# Altium project Timingcard_PROJECT.PrjPcb
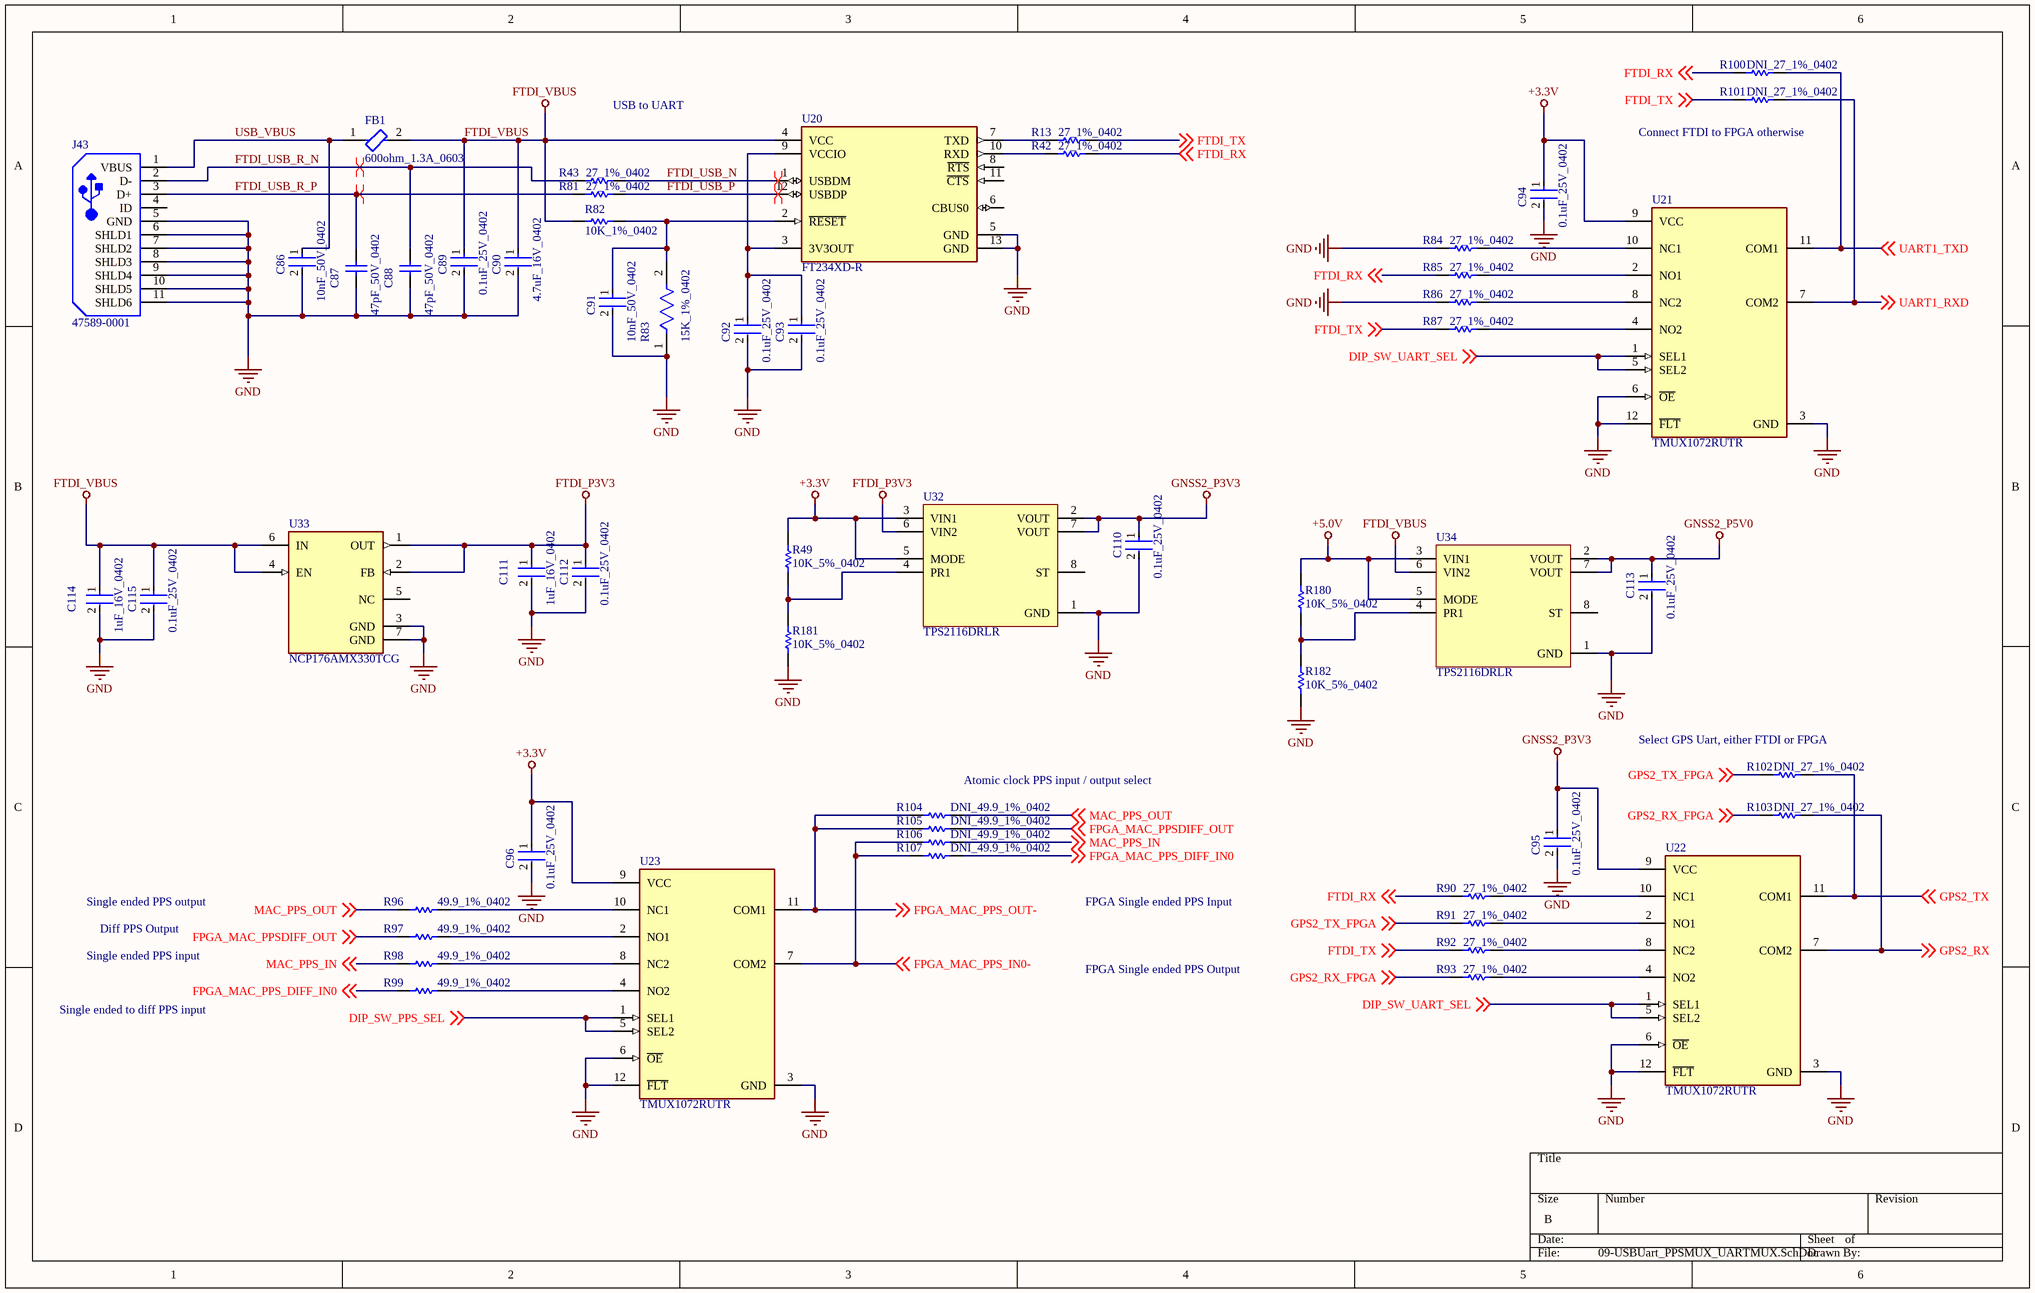
[diagram p0: 09-USBUart_PPSMUX_UARTMUX.SchDoc]
ProjectDate: 09/14/21; ProjectRevision: P3
1 sheet, 56 parts. Net scope: global (net labels, ports and power ports of the same name join across sheets).
Board file: QUANTUM-DC-V1_EXP.PcbDoc

## Sheet 09-USBUart_PPSMUX_UARTMUX.SchDoc
size B; SPICEModelCacheLIOYUQKN: <root> / <DocumentId>LIOYUQKN</DocumentId> / <CacheFrame Number="0"> / <Model Name="emk105bj105_v-f" Kind="CKT"> / <Text>* EMK105BJ105_V-F     SPICE MODEL  ( General Type ) / *-------------------------------------------------------------------------------------------------------- / * Model Generated by TAIYO YUDEN Corporation (http://www.ty-top.com) / * Version 1.0 / * TAIYO YUDEN Control No. 170508_130520 / * Copyright(c) 2012 TAIYO YUDEN CO.,LTD. All Rights Reserved. / *-------------------------------------------------------------------------------------------------------- / * / * Products Name : Multilayer Ceramic Capacitors / * / * Characteristics : / *     Capacitance : 1 uF , Rated Voltage : 16V , TCC : X5R / *     Case Size : 1.0 x 0.5 / 0.039 x 0.02 [mm/inch] , Thickness : 0.5 / 0.02 [mm/inch] / *     (Conditions: Temperature = 25 degC , DC Bias Current/Voltage = 0A / 0V) / * / * Frequency Range : 40Hz - 3GHz / * / * External Node Assignments : / * / *  1  o---| |---o  2 / * / *-------------------------------------------------------------------------------------------------------- / .SubCkt EMK105BJ105_V-F 1 2 / **************************** / C0 1 110 0.68309u / Cm 1 101 0.26053u / C1 101 102 0.94076u / Rc1 101 102 1.9029k / C2 102 103 0.66707u / Rc2 102 103 120.36 / C3 103 110 0.57203u / Rc3 103 110 2.1097 / C2m 1 301 0.1871u / C21 301 302 3.2494u / Rc21 301 302 1.1117k / C22 302 303 2.1014u / Rc22 302 303 1.484k / C23 303 304 2.1172u / Rc23 303 304 1.3876k / C24 304 305 0.75729u / Rc24 304 305 332.59 / C25 305 306 0.94401u / Rc25 305 306 249.09 / C26 306 307 0.34674u / Rc26 306 307 28.352 / C27 307 308 0.37158u / Rc27 307 308 19.989 / C28 308 309 0.17933u / Rc28 308 309 31.748 / C29 309 110 0.016445u / Rc29 309 110 1.0592 / Rp0 1 110 100Meg / L0 110 120 0.2216n / Lm 120 130 0.1509n / L1 120 121 0.12659n / RL1 121 130 0.85161 / L2 120 122 0.15996n / RL2 122 130 0.42469 / L3 120 123 7.9543n / RL3 123 130 0.54643m / CR 120 124 0.24334u / LR 124 125 0.090738n / RR 125 130 68.076m / CL 130 140 2.7354p / LL 130 140 0.10762n / RL 130 140 50.614 / Rs 140 2 7.5416m / **************************** / .ends EMK105BJ105_V-F</Text> / </Model> / </CacheFrame> / </root>

### Parts
C86  10nF_50V_0402  [FP-CC0402-MFG]
C87  47pF_50V_0402  [CAPC1005X55X25LL05T10]
C88  47pF_50V_0402  [CAPC1005X55X25LL05T10]
C89  0.1uF_25V_0402  [FP-0402-L_1_0_1-W_0_5_0_1-IPC_C]
C90  4.7uF_16V_0402  [FP-CL829-IPC_C]
C91  10nF_50V_0402  [FP-CC0402-MFG]
C92  0.1uF_25V_0402  [FP-0402-L_1_0_1-W_0_5_0_1-IPC_C]
C93  0.1uF_25V_0402  [FP-0402-L_1_0_1-W_0_5_0_1-IPC_C]
C94  0.1uF_25V_0402  [FP-0402-L_1_0_1-W_0_5_0_1-IPC_C]
C95  0.1uF_25V_0402  [FP-0402-L_1_0_1-W_0_5_0_1-IPC_C]
C96  0.1uF_25V_0402  [FP-0402-L_1_0_1-W_0_5_0_1-IPC_C]
C110  0.1uF_25V_0402  [FP-0402-L_1_0_1-W_0_5_0_1-IPC_C]
C111  1uF_16V_0402  [FP-0402-L_1_0_0_05-W_0_5-IPC_A]
C112  0.1uF_25V_0402  [FP-0402-L_1_0_1-W_0_5_0_1-IPC_C]
C113  0.1uF_25V_0402  [FP-0402-L_1_0_1-W_0_5_0_1-IPC_C]
C114  1uF_16V_0402  [FP-0402-L_1_0_0_05-W_0_5-IPC_A]
C115  0.1uF_25V_0402  [FP-0402-L_1_0_1-W_0_5_0_1-IPC_C]
FB1  600ohm_1.3A_0603  [FP-BLM18-0_15-t0_8-IPC_A]
J43  47589-0001  [MOLX-47589-0001_V]
R13  27_1%_0402  [RESC1005X40X25NL05T05]
R42  27_1%_0402  [RESC1005X40X25NL05T05]
R43  27_1%_0402  [RESC1005X40X25NL05T05]
R49  10K_5%_0402  [RESC1005X40X25ML05T05]
R81  27_1%_0402  [RESC1005X40X25NL05T05]
R82  10K_1%_0402  [RESC1005X40X25LL05T10]
R83  15K_1%_0402  [FP-ERJ2R-MFG]
R84  27_1%_0402  [RESC1005X40X25NL05T05]
R85  27_1%_0402  [RESC1005X40X25NL05T05]
R86  27_1%_0402  [RESC1005X40X25NL05T05]
R87  27_1%_0402  [RESC1005X40X25NL05T05]
R90  27_1%_0402  [RESC1005X40X25NL05T05]
R91  27_1%_0402  [RESC1005X40X25NL05T05]
R92  27_1%_0402  [RESC1005X40X25NL05T05]
R93  27_1%_0402  [RESC1005X40X25NL05T05]
R96  49.9_1%_0402  [RESC1005X40X25LL05T10]
R97  49.9_1%_0402  [RESC1005X40X25LL05T10]
R98  49.9_1%_0402  [RESC1005X40X25LL05T10]
R99  49.9_1%_0402  [RESC1005X40X25LL05T10]
R100  DNI_27_1%_0402  [RESC1005X40X25NL05T05]  (no BOM)
R101  DNI_27_1%_0402  [RESC1005X40X25NL05T05]  (no BOM)
R102  DNI_27_1%_0402  [RESC1005X40X25NL05T05]  (no BOM)
R103  DNI_27_1%_0402  [RESC1005X40X25NL05T05]  (no BOM)
R104  DNI_49.9_1%_0402  [RESC1005X40X25LL05T10]  (no BOM)
R105  DNI_49.9_1%_0402  [RESC1005X40X25LL05T10]  (no BOM)
R106  DNI_49.9_1%_0402  [RESC1005X40X25LL05T10]  (no BOM)
R107  DNI_49.9_1%_0402  [RESC1005X40X25LL05T10]  (no BOM)
R180  10K_5%_0402  [RESC1005X40X25ML05T05]
R181  10K_5%_0402  [RESC1005X40X25ML05T05]
R182  10K_5%_0402  [RESC1005X40X25ML05T05]
U20  FT234XD-R  [FP-DFN-12-IPC_B]
U21  TMUX1072RUTR  [FP-RUT0012A-MFG]
U22  TMUX1072RUTR  [FP-RUT0012A-MFG]
U23  TMUX1072RUTR  [FP-RUT0012A-MFG]
U32  TPS2116DRLR  [IC_TPS2116]
U33  NCP176AMX330TCG  [FP-711AT-MFG]
U34  TPS2116DRLR  [IC_TPS2116]

### Nets
+3.3V: C94.1 C96.1 R49.2 U21.9(VCC) U23.9(VCC) U32.3(VIN1) U32.5(MODE)
+5.0V: R180.2 U34.3(VIN1) U34.5(MODE)
FTDI_P3V3: C111.1 C112.1 U32.6(VIN2) U33.1(OUT) U33.2(FB)
FTDI_VBUS: C89.1 C90.1 C114.1 C115.1 FB1.2 R82.2 U20.4(VCC) U33.4(EN) U33.6(IN) U34.6(VIN2)
GND: C86.2 C87.1 C88.1 C89.2 C90.2 C91.2 C92.2 C93.2 C94.2 C95.2 C96.2 C110.2 C111.2 C112.2 C113.2 C114.2 C115.2 J43.5(GND) J43.6(SHLD1) J43.7(SHLD2) J43.8(SHLD3) J43.9(SHLD4) J43.10(SHLD5) J43.11(SHLD6) R83.1 R84.1 R86.1 R181.1 R182.1 U20.5(GND) U20.13(GND) U21.3(GND) U21.6(~{OE}) U21.12(~{FLT}) U22.3(GND) U22.6(~{OE}) U22.12(~{FLT}) U23.3(GND) U23.6(~{OE}) U23.12(~{FLT}) U32.1(GND) U33.3(GND) U33.7(GND) U34.1(GND)
GNSS2_P3V3: C95.1 C110.1 U22.9(VCC) U32.2(VOUT) U32.7(VOUT)
GNSS2_P5V0: C113.1 U34.2(VOUT) U34.7(VOUT)
DIP_SW_PPS_SEL: U23.1(SEL1) U23.5(SEL2) ; off-sheet DIP_SW_PPS_SEL
DIP_SW_UART_SEL: U21.1(SEL1) U21.5(SEL2) U22.1(SEL1) U22.5(SEL2) ; off-sheet DIP_SW_UART_SEL
FPGA_MAC_PPS_DIFF_IN0: R99.1 R107.2 ; off-sheet FPGA_MAC_PPS_DIFF_IN0
FPGA_MAC_PPS_IN0-: R106.1 R107.1 U23.7(COM2) ; off-sheet FPGA_MAC_PPS_IN0-
FPGA_MAC_PPS_OUT-: R104.1 R105.1 U23.11(COM1) ; off-sheet FPGA_MAC_PPS_OUT-
FPGA_MAC_PPSDIFF_OUT: R97.1 R105.2 ; off-sheet FPGA_MAC_PPSDIFF_OUT
FTDI_RX: R42.2 R85.1 R90.1 R100.1 ; off-sheet FTDI_RX
FTDI_TX: R13.2 R87.1 R92.1 R101.1 ; off-sheet FTDI_TX
FTDI_USB_N: R43.2 U20.1(USBDM)
FTDI_USB_P: R81.2 U20.12(USBDP)
FTDI_USB_R_N: C88.2 J43.2(D-) R43.1
FTDI_USB_R_P: C87.2 J43.3(D+) R81.1
GPS2_RX: R103.2 U22.7(COM2) ; off-sheet GPS2_RX
GPS2_RX_FPGA: R93.1 R103.1 ; off-sheet GPS2_RX_FPGA
GPS2_TX: R102.2 U22.11(COM1) ; off-sheet GPS2_TX
GPS2_TX_FPGA: R91.1 R102.1 ; off-sheet GPS2_TX_FPGA
MAC_PPS_IN: R98.1 R106.2 ; off-sheet MAC_PPS_IN
MAC_PPS_OUT: R96.1 R104.2 ; off-sheet MAC_PPS_OUT
UART1_RXD: R101.2 U21.7(COM2) ; off-sheet UART1_RXD
UART1_TXD: R100.2 U21.11(COM1) ; off-sheet UART1_TXD
USB_VBUS: C86.1 FB1.1 J43.1(VBUS)
NetC91_1: C91.1 R82.1 R83.2 U20.2(~{RESET})
NetC92_1: C92.1 C93.1 U20.3(3V3OUT) U20.9(VCCIO)
NetR13_1: R13.1 U20.7(TXD)
NetR42_1: R42.1 U20.10(RXD)
NetR49_1: R49.1 R181.2 U32.4(PR1)
NetR84_2: R84.2 U21.10(NC1)
NetR85_2: R85.2 U21.2(NO1)
NetR86_2: R86.2 U21.8(NC2)
NetR87_2: R87.2 U21.4(NO2)
NetR90_2: R90.2 U22.10(NC1)
NetR91_2: R91.2 U22.2(NO1)
NetR92_2: R92.2 U22.8(NC2)
NetR93_2: R93.2 U22.4(NO2)
NetR96_2: R96.2 U23.10(NC1)
NetR97_2: R97.2 U23.2(NO1)
NetR98_2: R98.2 U23.8(NC2)
NetR99_2: R99.2 U23.4(NO2)
NetR180_1: R180.1 R182.2 U34.4(PR1)

Not connected (* = marked no-connect by the designer): J43 4(ID); U20 6(CBUS0) 8(~{RTS}) 11(~{CTS}); U32 8(ST); U33 5(NC); U34 8(ST)

### Layout directives
differential pair: FTDI_USB_N, FTDI_USB_P, FTDI_USB_R_N, FTDI_USB_R_P

### Notes on the sheet
- USB to UART
- (near R101) Connect FTDI to FPGA otherwise
- (near R102) Select GPS Uart, either FTDI or FPGA
- Atomic clock PPS input / output select
- Single ended PPS output
- FPGA Single ended PPS Input
- Single ended PPS input
- Diff PPS Output
- FPGA Single ended PPS Output
- Single ended to diff PPS input

### Library data of the parts
C86 C91 = CMP-2100-03592-2: CAP CER 10000PF 50V X7R 0402; Manufacturer Part Number: CC0402KRX7R9BB103; Manufacturer: YAGEO; Temperature Coefficient: 30ppm/°C; Capacitance: 10 nF; Material: Ceramic; Automotive Grade: NA; Tolerance: 0.1; Value: 10 nF; Device Class L3: Ceramic Capacitors; Temperature: -55°C to +125°C; Footprint Url: http://www.yageo.com/exep/pages/download/literatures/UPY-C_GEN_24.pdf; Ipc Land Pattern Name: CAPC10050X50; Device Class L1: Passive Components; Automotive: No; Octopart: https://octopart.com/cc0402krx7r9bb103-yageo-8376513; Lead Free: Yes; Temperature Range Low: -55°C; Height: 0.55mm; ComponentLink2URL: http://www.yageo.com/documents/recent/UPY-GP_NP0_16V-to-50V_16.pdf; Category: Cap; ComponentLink2Description: Datasheet; Temperature Range High: +125°C; Digikey Description: CAP CER 10000PF 50V X7R 0402; Voltage Rating: 50 V; Package: CC0402; Device Class L2: Capacitors; Mouser Description: 0402 10 nF 50 V ±10 % Tolerance X7R SMT Multilayer Ceramic Capacitor; RoHS: TRUE; Temperature Characteristic: X7R
C87 C88 = CMP-2008-04368-1: Part Number: GRM1555C1H470JA01D; Manufacturer: Murata
C89 C92-C96 C110 C112 C113 C115 = CMP-2008-02519-2: General Purpose Ceramic Capacitor, 0402, 100nF, 10%, X7R, 15%, 25V; Package Quantity: 1; Capacitance: 100nF; Min Operating Temperature: -55°C; Voltage: 25V; Voltage Rating: 25V; Construction: Flat; Max Operating Temperature: 125°C; Radiation Hardening: No; Depth: 0.5mm; Thickness: 0.022inch; Voltage Rating (DC): 25V; Number of Pins: 2; Lead Free: Lead Free; Series: -; REACH SVHC: No SVHC; Length: 1mm; Dielectric: X7R; RoHS Compliant: Yes; Mount: Surface Mount; Packaging: Tape and Reel; Case/Package: 0402; Case Code (Imperial): 0402; Termination: SMD/SMT; Width: 0.02inch; Case Code (Metric): 1005; Tolerance: 10%
C90 = CMP-13271-001468-1: Cap Ceramic 4.7uF 16V X5R ±20% SMD 0402 +85°C Paper T/R; Mount: Surface Mount; Case Code (Metric): 1005; Case/Package: 0402; Length: 0.039inch; Capacitance: 4.7uF; Voltage Rating: 16V; Max Operating Temperature: 85°C; Tolerance: 20%; Thickness: 0.022inch; Min Operating Temperature: -55°C; Case Code (Imperial): 0402; Packaging: Tape and Reel; Width: 0.02inch
C111 C114 = CMP-14477-000104-2: None; Tolerance: 10%; Voltage Rating: 16V; Dielectric: X5R; Capacitance: 1uF; Packaging: Tape and Reel; Depth: 0.5mm; Mount: Surface Mount; Thickness: 0.022inch; Package Quantity: 1; Min Operating Temperature: -55°C; Series: M; Voltage Rating (DC): 16V; Termination: SMD/SMT; Case/Package: 0402; Number of Pins: 2; Case Code (Imperial): 0402; Length: 1mm; Halogen Free: Halogen Free; Case Code (Metric): 1005; Width: 0.02inch; RoHS Compliant: Yes; Radiation Hardening: No; Max Operating Temperature: 85°C; Height: 0.5mm; Construction: Flat
FB1 = CMP-0686-00581-3: Chip Ferrite Bead, 0603, 600Ω @ 100MHz, 0.15Ω, 25%, 1.3A; Material: Steel; Number of Lines: 1; Impedance: 600R; DC Resistance (DCR): 150mR; Tolerance: 25%; Case Code (Metric): 1608; Width: 0.8mm; DC Current: 1.3A; Max DC Current: 1.3A; Package Quantity: 1; Number of Pins: 2; Military Standard: Not; RoHS Compliant: Yes; Termination: SMD/SMT; Max Operating Temperature: 125°C; Length: 1.6mm; Depth: 0.8mm; Case Code (Imperial): 0603; Series: BLM18K; Inductor Type: FERRITE BEAD; Core Material: Ferrite; Number of Circuits: 1; Height: 0.8mm; Case/Package: 0603; REACH SVHC: No SVHC; Packaging: Tape and Reel; Min Operating Temperature: -55°C; Max Current Rating: 1.3A; Radiation Hardening: No; Current Rating: 1.3A; Lead Free: Lead Free; Test Frequency: 100MHz; Weight: 7.1E-05oz
J43 = CMP-2000-05610-1: Right Angle Female Type AB Micro USB Connector, 30 V, 1.8 A, -30 to 85 degC, RoHS, Tape and Reel; Number of Ports: 1Port; Current Rating: 1.8A; Brand: Molex; Connector Type: MicroUSBTypeABreceptacle; Number of Contacts: 5Contact; Voltage Rating: 30VAC; Color: Black; Product: MicroUSBTypeABConnectors; Package URL: http://www.molex.com/pdm_docs/sd/475890001_sd.pdf; Contact Plating: Gold; Datasheet URL: http://www.molex.com/webdocs/datasheets/pdf/en-us/0475890001_IO_CONNECTORS.pdf; Operating Temperature Range: -20Cto+85C; Termination Style: SMD/SMT; Mounting Angle: Right; Package Reference: 47589-0001; Gender: Female; Package Description: Micro USB Connector, Pitch 0.65 mm, 5 Positions, Body 7.5 x 5.6 mm; Mounting Technology: SurfaceMount; Contact Material: CopperAlloy; Packaging: Reel; RoHS: True; Standard: USB; Manufacturer URL: http://www.molex.com/; Manufacturer: Molex; Datasheet Version: 12/2016; Product Category: USBConnectors; Series: 47589
R13 R42 R43 R81 R84-R87 R90-R93 R100-R103 = CMP-2002-08434-1: Part Number: CRCW040227R0FKED; Manufacturer: Vishay Dale
R49 R180-R182 = CMP-2002-00433-1: Part Number: ERJ-2GEJ103X; Manufacturer: Panasonic
R82 = CMP-2002-07353-1: Part Number: RC0402FR-0710KL; Manufacturer: Yageo / Phycomp
R83 = CMP-2002-00694-4: RES SMD 15K OHM 1% 1/10W 0402; Manufacturer Part Number: ERJ-2RKF1502X; Manufacturer: Panasonic; Automotive Grade: Grade 0; Voltage Rating: 50V; Resistance: 15kΩ; Temperature Coefficient: 100ppm/°C; Power Rating: 0.1W; Value: 15kΩ; ComponentLink2URL: https://industrial.panasonic.com/cdbs/www-data/pdf/RDA0000/AOA0000C304.pdf; Automotive: Yes; Temperature: -55°C to +155°C; Height: 0.4mm; Digikey Description: RES SMD 15K OHM 1% 1/10W 0402; Category: Res; Device Class L2: Resistors; Device Class L1: Passive Components; Package: ERJ2R; Temperature Range Low: -55°C; Tolerance: 1%; Series: ERJ; Footprint Url: https://b2b-api.panasonic.eu/file_stream/pids/fileversion/1180; Mouser Description: Res Thick Film 1.0 x 0.5 mm 15K Ohm 1% 0.1W(1/10W) 100ppm/ C Molded SMD Punched Carrier T/R; Composition: Thick Film; Lead Free: Yes; Device Class L3: Chip SMD Resistors; Octopart: https://octopart.com/erj-2rkf1502x-panasonic-55404985; RoHS: TRUE; Temperature Range High: +155°C; ComponentLink2Description: Datasheet
R96-R99 R104-R107 = CMP-2002-07709-1: Manufacturer: Yageo / Phycomp; Part Number: RC0402FR-0749R9L
U20 = CMP-0248-00027-3: IC USB SERIAL BASIC UART 12DFN; Min Supply Voltage: 2.97V; Number of Ports: 1; Operating Supply Voltage: 5V; Operating Supply Current: 8mA; Max Supply Voltage: 5.5V; Data Rate: 3Mbps; Length: 3mm; Case/Package: DFN; Mount: Surface Mount; Packaging: Tape and Reel; Max Operating Temperature: 85°C; Height: 0.75mm; Number of Pins: 12; Number of Transceivers: 1; Package Quantity: 5000; Min Operating Temperature: -40°C; Width: 3mm; REACH SVHC: No SVHC; Interface: UART; Lead Free: Lead Free
U21-U23 = CMP-04892-000114-1: IC SWITCH SPDT DUAL 12UQFN; Number of Circuits: 2; -3db Bandwidth: 1.2GHz; On-State Resistance: 18R; Number of Pins: 12; Min Operating Temperature: -40°C; RoHS Compliant: Yes; Max Operating Temperature: 125°C; Number of Channels: 2; Packaging: Tape and Reel
U32 U34 = IC_TPS2116DRLR: 1.6-V to 5.5-V, 40-mΩ, 2.5-A, low-IQ, priority power multiplexer 8-SOT-5X3 -40 to 125; MF: Texas Instruments; Check_prices: https://www.snapeda.com/parts/TPS2116DRLR/Texas%20Instruments/view-part/5674360/?ref=eda; MP: TPS2116DRLR; Package: Package; Price: None; Availability: No availability data; SnapEDA_Link: https://www.snapeda.com/parts/TPS2116DRLR/Texas%20Instruments/view-part/5674360/?ref=snap; Value: *; Supplier 1: LCSC; Manufacturer: Texas Instruments; Manufacturer Part Number: TPS2116DRLR; RoHS: Yes; Category: Voltage Supervisors; Stock 1: 562; Pricing 1: 1=0.6651, 10=0.5457, 30=0.4853, 100=0.4264, 500=0.3914, 1000=0.3723 (USD); Supplier Part Number 1: C3235557
U33 = CMP-07128-000022-1: IC REG LINEAR 3.3V 500MA 6XDFN; Manufacturer: ON Semiconductor; Output Type: Fixed; Dropout Voltage: 295mV; Number Of Outputs: 1; Standoff Height: 0mm; Min Supply Voltage: 1.4V; Nominal Supply Current: 60uA; Max Supply Voltage: 5.5V; Max Junction Temp: +150°C; Accuracy Percentage: 0.8%; Footprint Url: https://www.onsemi.com/pub/Collateral/711AT.PDF; Device Class L2: Power Management ICs; Device Class L1: Integrated Circuits (ICs); Digikey Description: IC REG LINEAR 3.3V 500MA 6XDFN; ComponentLink2Description: Datasheet; Output Voltage: 3.3V; ComponentLink2URL: https://www.onsemi.com/pub/Collateral/NCP176-D.PDF; RoHS: TRUE; Lead Free: Yes; Output Current: 500mA; Automotive: No; Temperature Range High: +150°C; Height: 0.45mm; Package: 711AT; Device Class L3: Voltage Regulators - Linear; Octopart: https://octopart.com/ncp176amx330tcg-on+semiconductor-61522616; Category: IC; Manufacturer Part Number: NCP176AMX330TCG; Ipc Land Pattern Name: DFN120X120X37-6; Temperature: to +150°C